# Altium schematic sheet IO.SchDoc
size A4
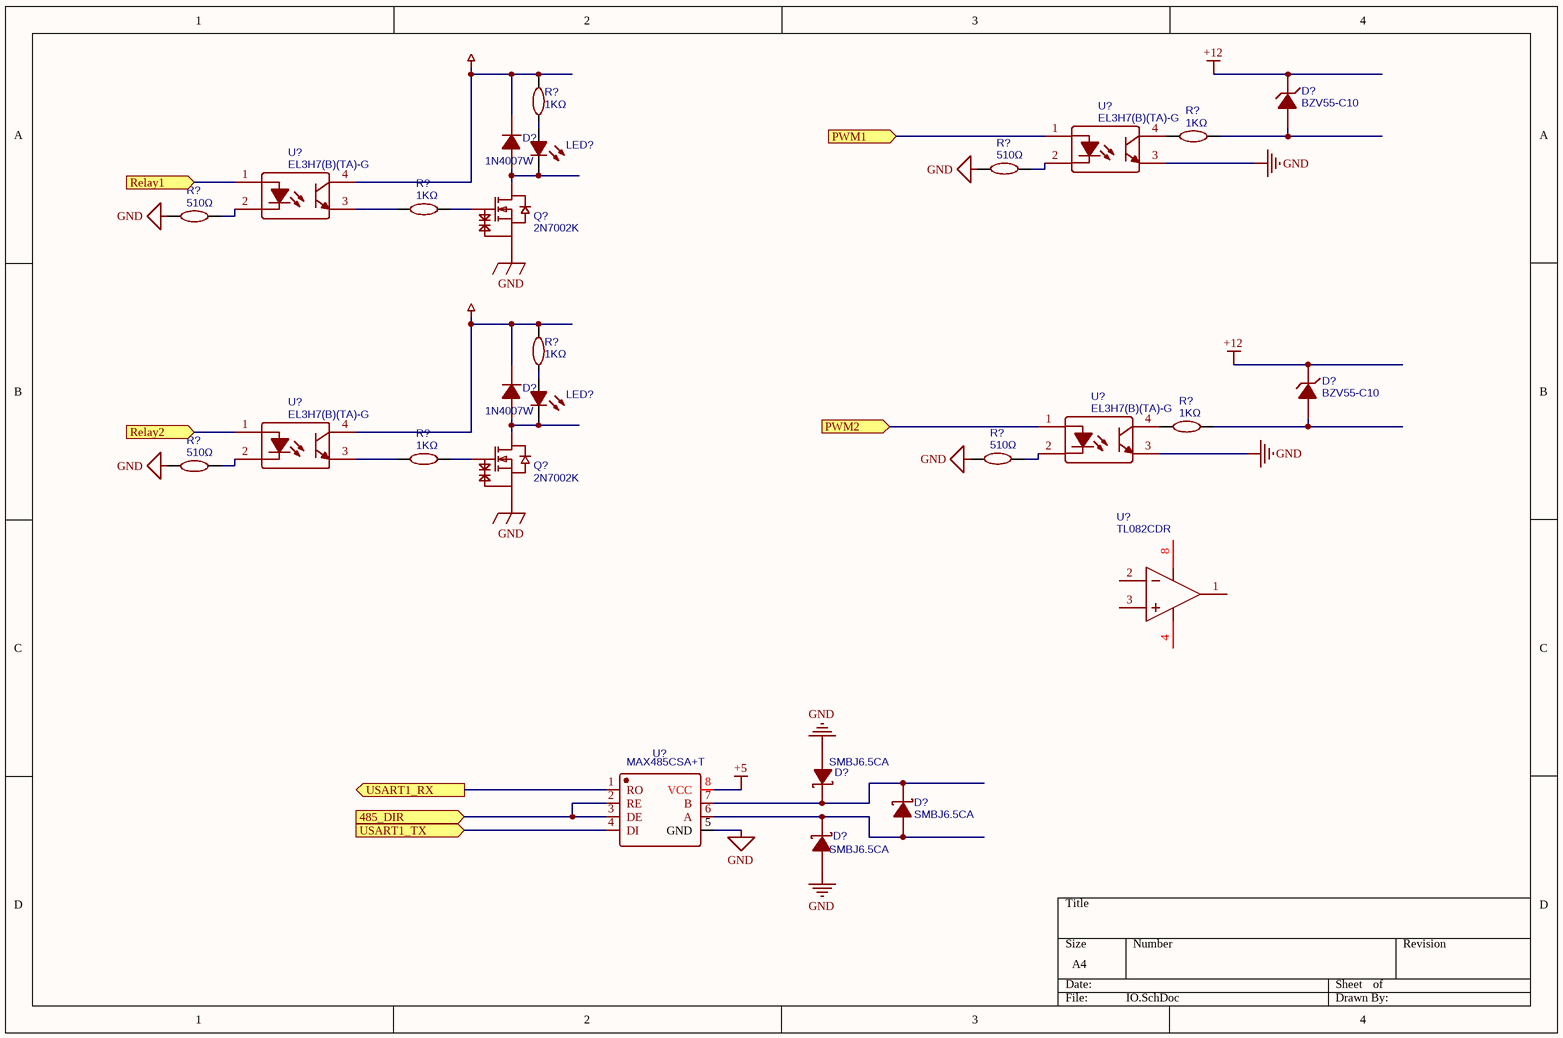
[diagram p0: IO.SchDoc]

## Parts
(Parts that share a designator on the sheet are numbered #1, #2 ... from top to bottom, then left to right.)
D?#1  BZV55-C10  [SOD80C]
D?#2  1N4007W  [SOD-123FL]
D?#3  1N4007W  [SOD-123FL]
D?#4  BZV55-C10  [SOD80C]
D?#5  SMBJ6.5CA  [SMB(DO-214AA)]
D?#6  SMBJ6.5CA  [SMB(DO-214AA)]
D?#7  SMBJ6.5CA  [SMB(DO-214AA)]
LED?#1  19-217/GHC-YR1S2/3T  [LED-0603]  (value not drawn)
LED?#2  19-217/GHC-YR1S2/3T  [LED-0603]  (value not drawn)
Q?#1  2N7002K  [SOT-23(SOT-23-3)]
Q?#2  2N7002K  [SOT-23(SOT-23-3)]
R?#1  1KΩ  [0603]
R?#2  1KΩ  [0603]
R?#3  510Ω  [0603]
R?#4  1KΩ  [0603]
R?#5  510Ω  [0603]
R?#6  1KΩ  [0603]
R?#7  1KΩ  [0603]
R?#8  1KΩ  [0603]
R?#9  510Ω  [0603]
R?#10  510Ω  [0603]
U?#1  EL3H7(B)(TA)-G  [SOP-4_P1.27]
U?#2  EL3H7(B)(TA)-G  [SOP-4_P1.27]
U?#3  EL3H7(B)(TA)-G  [SOP-4_P1.27]
U?#4  EL3H7(B)(TA)-G  [SOP-4_P1.27]
U?#5  TL082CDR  [SOIC-8_150MIL]
U?#6  MAX485CSA+T  [SOIC-8_150MIL]

## Ports
485_DIR (in), PWM1 (in), PWM2 (in), Relay1 (in), Relay2 (in), USART1_RX (out), USART1_TX (in)

## Nets
+5: U?#6.8(VCC)
+12: D?#1.2(K) D?#4.2(K)
GND: D?#5.1 D?#7.1 Q?#1.2(S) Q?#2.2(S) R?#3.1 R?#5.1 R?#9.1 R?#10.1 U?#1.3(EM) U?#3.3(EM) U?#6.5(GND)
NetD?#2_1: D?#2.1(K) D?#3.1(K) R?#1.1 R?#6.1 U?#2.4(COL) U?#4.4(COL)
485_DIR: U?#6.2(RE) U?#6.3(DE) ; port 485_DIR
PWM1: U?#1.1(AN) ; port PWM1
PWM2: U?#3.1(AN) ; port PWM2
Relay1: U?#2.1(AN) ; port Relay1
Relay2: U?#4.1(AN) ; port Relay2
USART1_RX: U?#6.1(RO) ; port USART1_RX
USART1_TX: U?#6.4(DI) ; port USART1_TX
NetD?#1_1: D?#1.1(A) R?#2.2
NetD?#2_2: D?#2.2(A) LED?#1.2(C) Q?#1.3(D)
NetD?#3_2: D?#3.2(A) LED?#2.2(C) Q?#2.3(D)
NetD?#4_1: D?#4.1(A) R?#7.2
NetD?#5_2: D?#5.2 D?#6.2 U?#6.7(B)
NetD?#6_1: D?#6.1 D?#7.2 U?#6.6(A)
NetLED?#1_1: LED?#1.1(A) R?#1.2
NetLED?#2_1: LED?#2.1(A) R?#6.2
NetQ?#1_1: Q?#1.1(G) R?#4.2
NetQ?#2_1: Q?#2.1(G) R?#8.2
NetR?#2_1: R?#2.1 U?#1.4(COL)
NetR?#3_2: R?#3.2 U?#1.2(CAT)
NetR?#4_1: R?#4.1 U?#2.3(EM)
NetR?#5_2: R?#5.2 U?#2.2(CAT)
NetR?#7_1: R?#7.1 U?#3.4(COL)
NetR?#8_1: R?#8.1 U?#4.3(EM)
NetR?#9_2: R?#9.2 U?#3.2(CAT)
NetR?#10_2: R?#10.2 U?#4.2(CAT)

Not connected (* = marked no-connect by the designer): U?#5 1(OUT1) 2(IN1-) 3(IN1+) 4(VCC-) 8(VCC+)

## Library data of the parts
D?#1 D?#4 = (no symbol name): BOM_Manufacturer: NXP; Contributor: LCSC; BOM_Supplier: LCSC; BOM_LCSC: C108431; BOM_Manufacturer Part: BZV55-C10; spicePre: D
D?#2 D?#3 = (no symbol name): BOM_Manufacturer: Jingdao; BOM_Supplier: LCSC; BOM_Manufacturer Part: 1N4007W; BOM_LCSC: C108803; spicePre: D
D?#5-D?#7 = (no symbol name): BOM_Manufacturer: MDD; BOM_Supplier: LCSC; BOM_Manufacturer Part: SMBJ6.5CA; BOM_LCSC: C113979; spicePre: D
LED?#1 LED?#2 U?#1-U?#4 = (no symbol name): BOM_Manufacturer: EVERLIGHT; BOM_Supplier: LCSC
  LED?#1 LED?#2: BOM_Manufacturer Part: 19-217/GHC-YR1S2/3T; BOM_LCSC: C72043; BOM_LCSC Assembly: Yes; image: //image.lceda.cn/szlcsc/C72043.jpg; spicePre: L
  U?#1-U?#4: BOM_Manufacturer Part: EL3H7(B)(TA)-G; BOM_LCSC: C32565; image: //image.lceda.cn/szlcsc/C32565.jpg; spicePre: U
Q?#1 Q?#2 = (no symbol name): BOM_Manufacturer: CJ; BOM_Supplier: LCSC; BOM_Manufacturer Part: 2N7002K; BOM_LCSC: C38161; image: //image.lceda.cn/szlcsc/C38161.jpg; spicePre: Q
R?#1 R?#2 R?#4 R?#6-R?#8 = (no symbol name): BOM_Manufacturer: UniOhm; BOM_Manufacturer Part: 0603WAF1001T5E; nameAlias: Value; BOM_Supplier: LCSC; BOM_LCSC: C21190; BOM_LCSC Assembly: Yes; spicePre: R; spiceSymbolName: 0603WAF1001T5E
R?#3 R?#5 R?#9 R?#10 = (no symbol name): BOM_Manufacturer: UniOhm; BOM_Manufacturer Part: 0603WAF5100T5E; nameAlias: Value; BOM_Supplier: LCSC; BOM_LCSC: C23193; BOM_LCSC Assembly: Yes; spicePre: R; spiceSymbolName: 0603WAF5100T5E
U?#5 = (no symbol name): BOM_Manufacturer: TI; BOM_Supplier: LCSC; BOM_Manufacturer Part: TL082CDR; BOM_LCSC: C9385; image: //image.lceda.cn/szlcsc/C9385.jpg; spicePre: U
U?#6 = (no symbol name): BOM_Manufacturer: MAXIM; BOM_Supplier: LCSC; BOM_Manufacturer Part: MAX485CSA+T; BOM_LCSC: C9945; image: //image.lceda.cn/szlcsc/C9945.jpg; spicePre: U